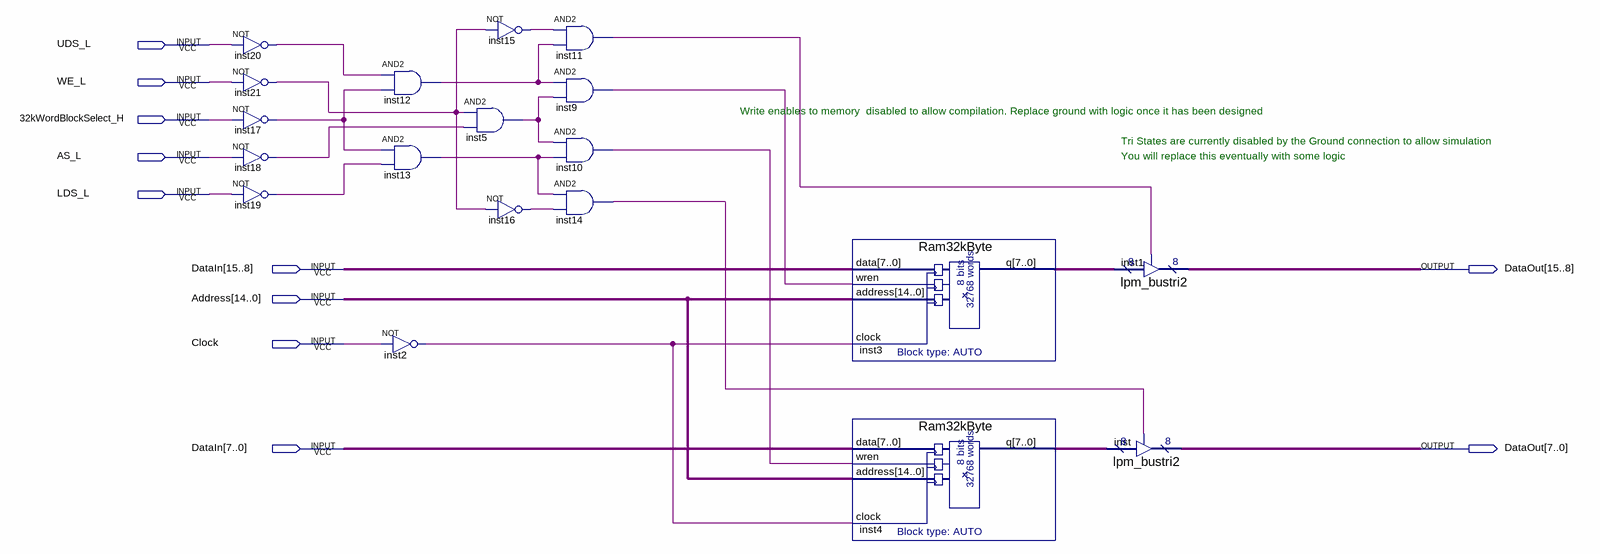
[diagram p0: schematic sheet]
// Quartus schematic SramBlock_32KWord.bdf as structural Verilog: 19 symbols, 11 pins
module SramBlock_32KWord (
  input  UDS_L,
  input  WE_L,
  input  \32kWordBlockSelect_H ,
  input  AS_L,
  input  LDS_L,
  input  [15:0] DataIn,
  input  [14:0] Address,
  input  Clock,
  output [15:0] DataOut
);

  wire inst2_out, inst5_out, inst9_out, inst10_out, inst11_out, inst12_out, inst13_out, inst14_out,
       inst15_out, inst16_out, inst17_out, inst18_out, inst19_out, inst20_out, inst21_out;
  wire [7:0] inst3_q, inst4_q;

  not inst20 (inst20_out, UDS_L);
  not inst21 (inst21_out, WE_L);
  not inst17 (inst17_out, \32kWordBlockSelect_H );
  not inst18 (inst18_out, AS_L);
  not inst19 (inst19_out, LDS_L);
  and inst12 (inst12_out, inst20_out, inst17_out);
  and inst13 (inst13_out, inst17_out, inst19_out);
  not inst2 (inst2_out, Clock);
  not inst15 (inst15_out, inst21_out);
  and inst5 (inst5_out, inst21_out, inst18_out);
  not inst16 (inst16_out, inst21_out);
  and inst11 (inst11_out, inst15_out, inst12_out);
  and inst9 (inst9_out, inst12_out, inst5_out);
  and inst10 (inst10_out, inst5_out, inst13_out);
  and inst14 (inst14_out, inst13_out, inst16_out);
  Ram32kByte inst3 (.data(DataIn[15:8]), .wren(inst9_out), .address(Address), .clock(inst2_out), .q(inst3_q));
  Ram32kByte inst4 (.data(DataIn[7:0]), .wren(inst10_out), .address(Address), .clock(inst2_out), .q(inst4_q));
  lpm_bustri2 inst1 (.enabledt(inst11_out), .data(inst3_q), .tridata(DataOut[15:8]));
  lpm_bustri2 inst (.enabledt(inst14_out), .data(inst4_q), .tridata(DataOut[7:0]));

  // Notes on the sheet:
  //   Write enables to memory  disabled to allow compilation. Replace ground with logic once it has been designed
  //   Tri States are currently disabled by the Ground connection to allow simulation
  //   You will replace this eventually with some logic
endmodule
